# EAGLE design template (EAGLE 6.5.0)
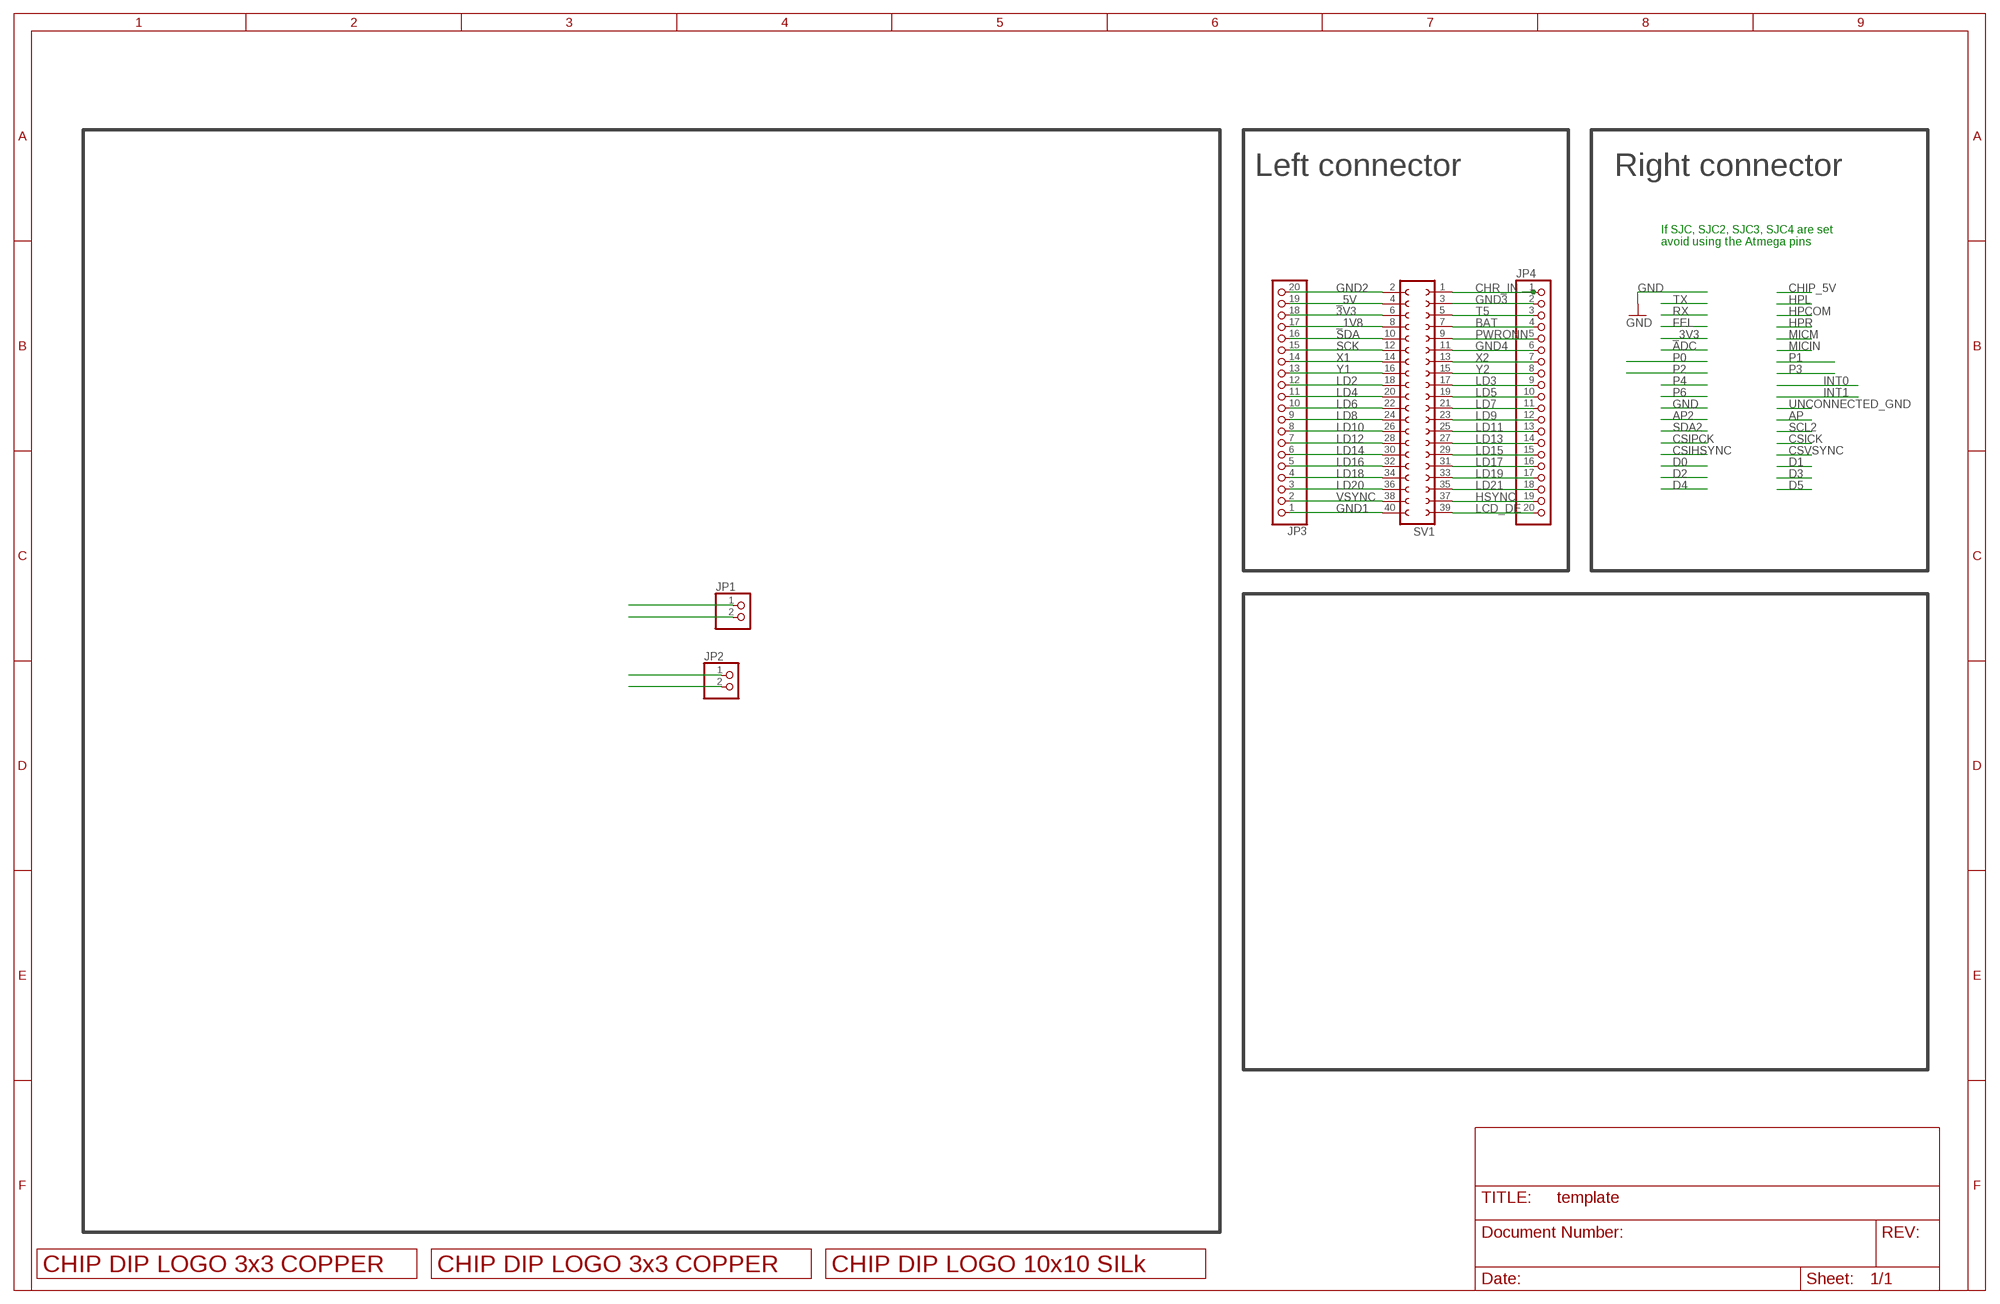
[diagram p0: schematic, sheet 1]

## Parts
JP1  PINHD-1X2  [1X02]
JP2  PINHD-1X2  [1X02]
JP3  PINHD-1X20  [1X20]
JP4  PINHD-1X20  [1X20]
SV1  FE20-2  [FE20-2]
U$2  LOGO_3X3_COPPER  [LOGO_3X3_COPPER]
U$4  LOGO_3X3_COPPER  [LOGO_3X3_COPPER]
U$5  LOGO_10X10_SILK  [LOGO_10X10_SILK]

## Nets
3V3: JP2.2 JP3.18 SV1.6
_1V8: JP3.17 SV1.8
_5V: JP3.19 SV1.4
BAT: JP4.4 SV1.7
CHR_IN: JP1.1 JP4.1 SV1.1
GND1: JP3.1 SV1.40
GND2: JP1.2 JP3.20 SV1.2
GND3: JP2.1 JP4.2 SV1.3
GND4: JP4.6 SV1.11
HSYNC: JP4.19 SV1.37
LCD_DE: JP4.20 SV1.39
LD2: JP3.12 SV1.18
LD3: JP4.9 SV1.17
LD4: JP3.11 SV1.20
LD5: JP4.10 SV1.19
LD6: JP3.10 SV1.22
LD7: JP4.11 SV1.21
LD8: JP3.9 SV1.24
LD9: JP4.12 SV1.23
LD10: JP3.8 SV1.26
LD11: JP4.13 SV1.25
LD12: JP3.7 SV1.28
LD13: JP4.14 SV1.27
LD14: JP3.6 SV1.30
LD15: JP4.15 SV1.29
LD16: JP3.5 SV1.32
LD17: JP4.16 SV1.31
LD18: JP3.4 SV1.34
LD19: JP4.17 SV1.33
LD20: JP3.3 SV1.36
LD21: JP4.18 SV1.35
PWRONN: JP4.5 SV1.9
SCK: JP3.15 SV1.12
SDA: JP3.16 SV1.10
T5: JP4.3 SV1.5
VSYNC: JP3.2 SV1.38
X1: JP3.14 SV1.14
X2: JP4.7 SV1.13
Y1: JP3.13 SV1.16
Y2: JP4.8 SV1.15

## Notes on the sheet
- Left connector | Right connector
- If SJC, SJC2, SJC3, SJC4 are set 
  avoid using the Atmega pins

## Library data of the parts
JP1 JP2 = pinhead:PINHD-1X2: PIN HEADER
JP3 JP4 = pinhead:PINHD-1X20: PIN HEADER
SV1 = con-lsta:FE20-2: FEMALE HEADER; OC_FARNELL: unknown; OC_NEWARK: unknown
U$2 U$4 = logo:LOGO_3X3_COPPER
U$5 = logo:LOGO_10X10_SILK

## Board
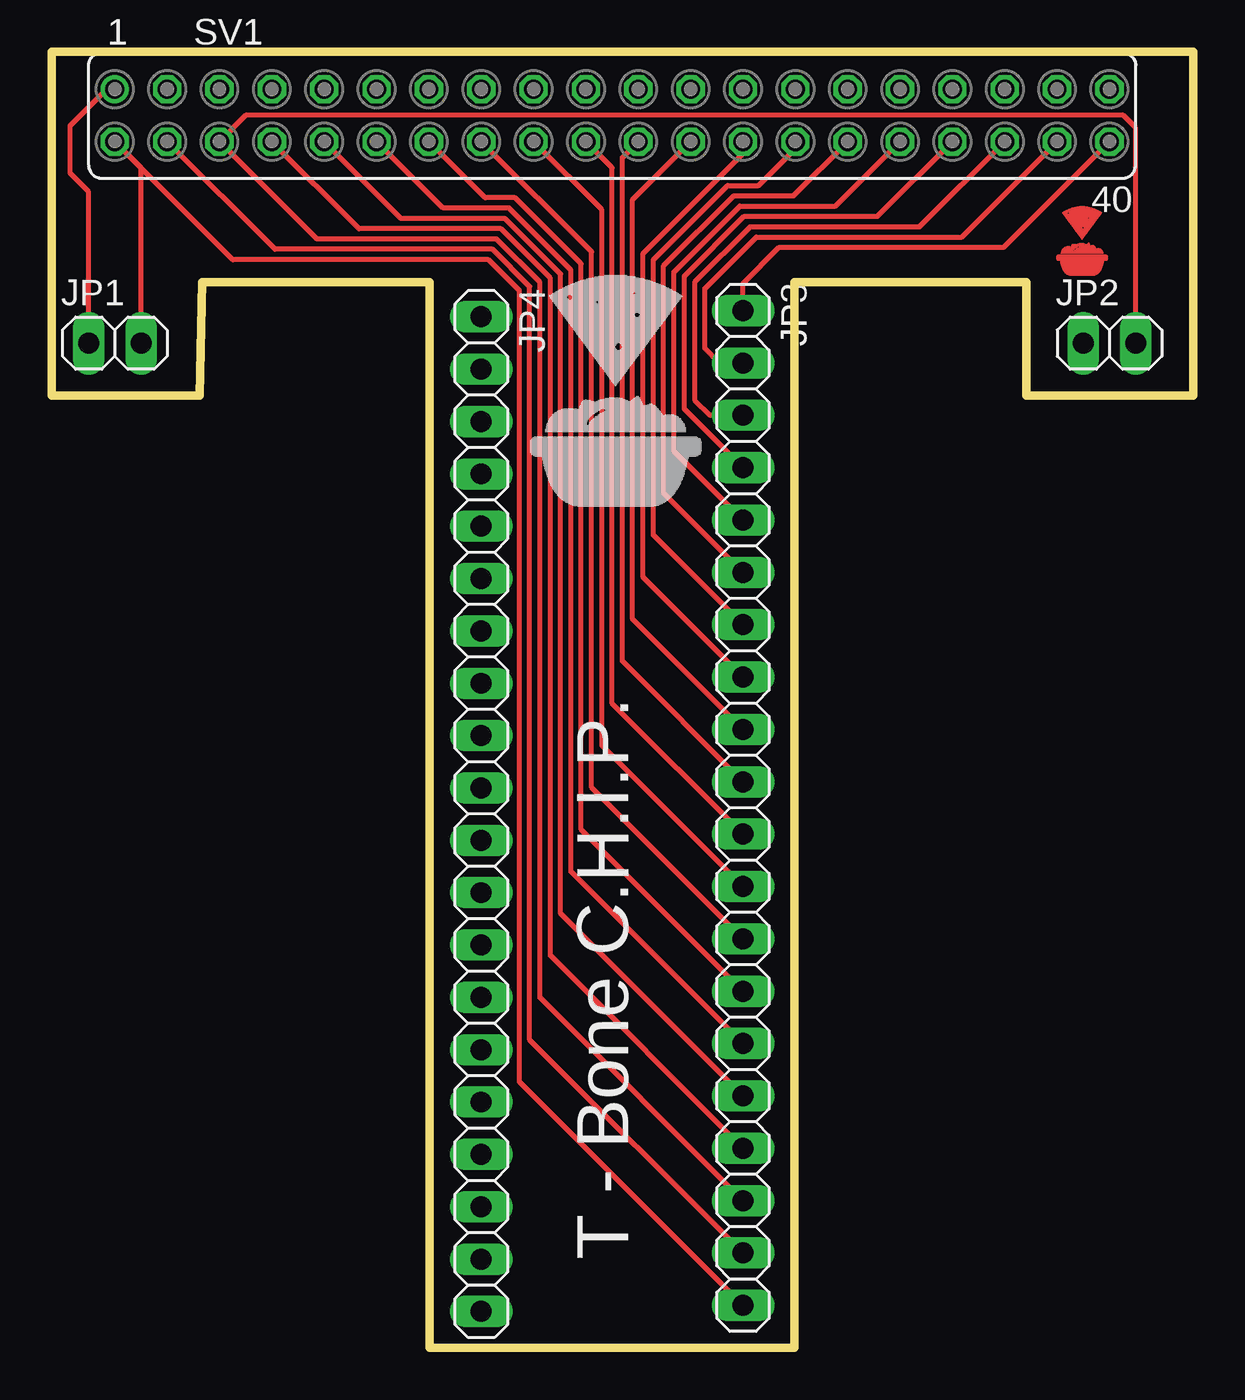
[diagram p1: board, top side]
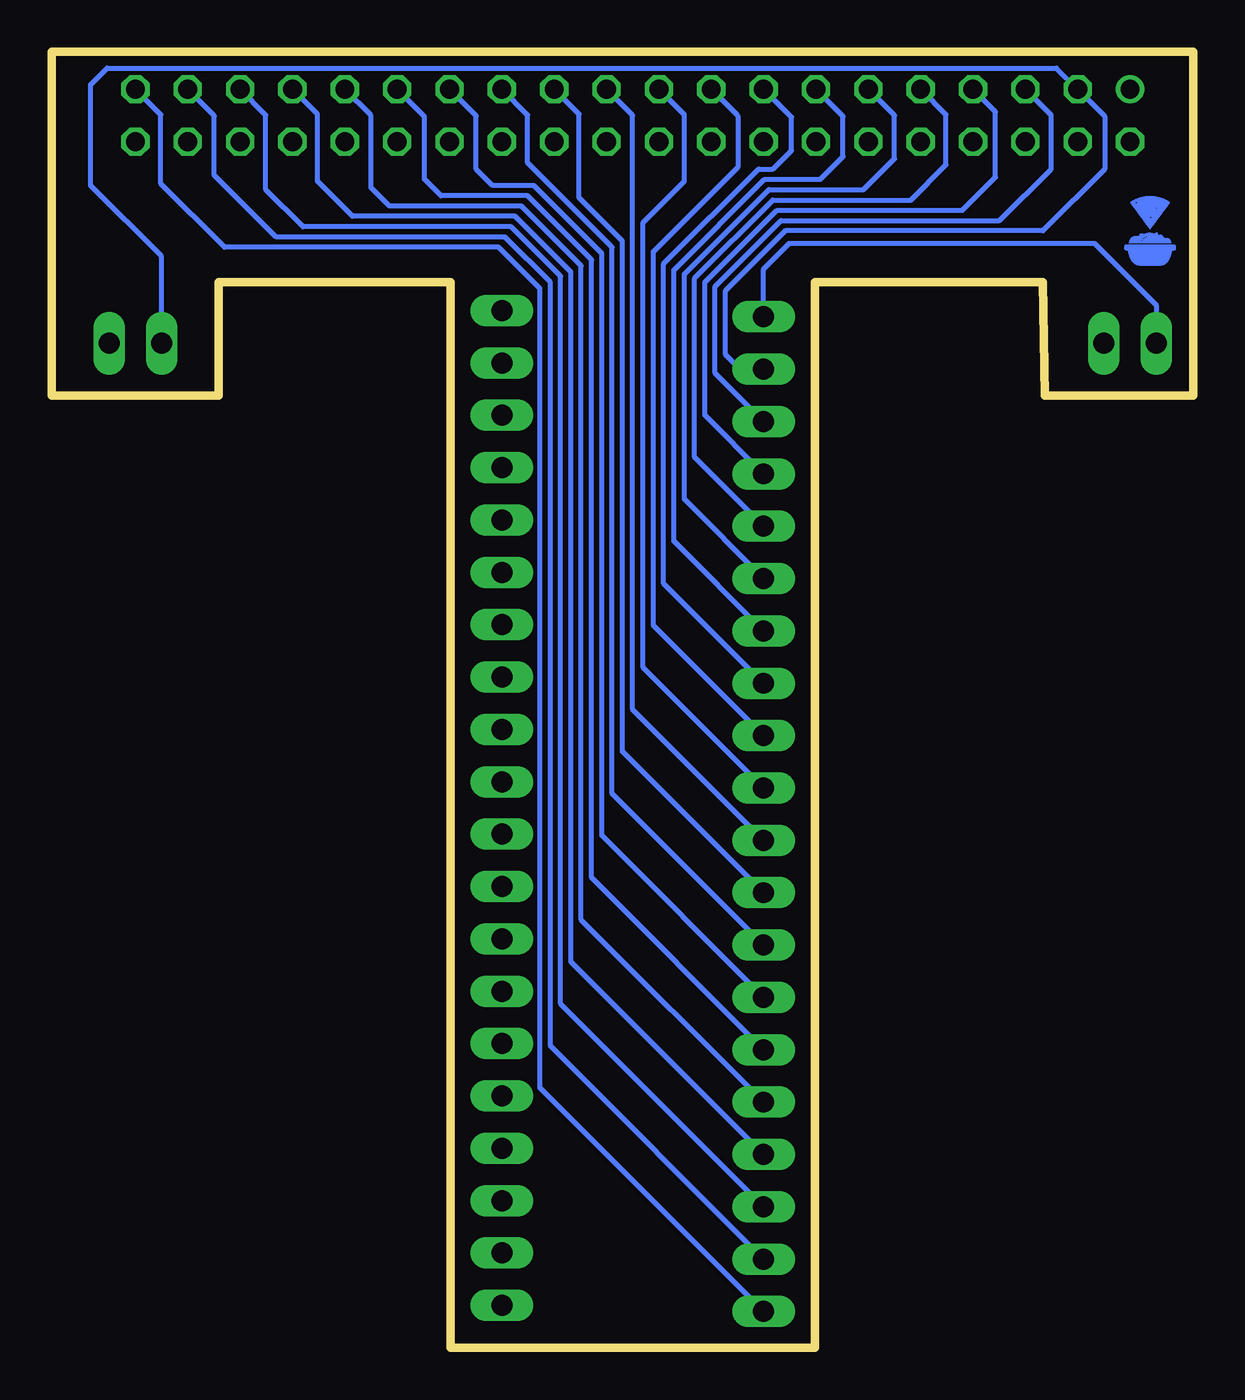
[diagram p2: board, bottom side, seen from below]

Size 55.4 x 62.9 mm. Coordinates in mm from the lower left corner, seen from the top.
Outline: 55.4,62.9 55.4,46.2 47.3,46.2 47.3,51.7 36.05,51.7 36.05,0 18.35,0 18.35,51.7 7.3,51.7 7.2,46.2 0,46.2 0,62.9 55.4,62.9
Copper layers (1*16): Top 0.0356mm / dielectric 1.5011mm / Bottom 0.0356mm
Design rules "LaenPCBOrder": minimum track width 6mil, minimum drill 13mil, track to track 6mil, track to pad 6mil, pad to pad 6mil, via to via 6mil, smd to smd 6mil, copper to edge 15mil, drill to drill 6mil, minimum pad ring 7mil, minimum via ring 7mil, stop-mask expansion 3mil, vias tented up to drill 0mil, thermal gap 10mil

### Footprints (pad centres in the part's own frame; a part is rotated, then mirrored left to right if it is on the bottom)
1X02 = drill 1.016 long: 1 -1.27,0; 2 1.27,0
1X20 = drill 1.016 long: 1 -24.13,0; 2 -21.59,0; 3 -19.05,0; 4 -16.51,0; 5 -13.97,0; 6 -11.43,0; 7 -8.89,0; 8 -6.35,0; 9 -3.81,0; 10 -1.27,0; 11 1.27,0; 12 3.81,0; 13 6.35,0; 14 8.89,0; 15 11.43,0; 16 13.97,0; 17 16.51,0; 18 19.05,0; 19 21.59,0; 20 24.13,0
FE20-2 = drill 0.914: 1 -24.13,1.27 | drill 0.914 octagon: 2 -24.13,-1.27; 3 -21.59,1.27; 4 -21.59,-1.27; 5 -19.05,1.27; 6 -19.05,-1.27; 7 -16.51,1.27; 8 -16.51,-1.27; 9 -13.97,1.27; 10 -13.97,-1.27; 11 -11.43,1.27; 12 -11.43,-1.27; 13 -8.89,1.27; 14 -8.89,-1.27; 15 -6.35,1.27; 16 -6.35,-1.27; 17 -3.81,1.27; 18 -3.81,-1.27; 19 -1.27,1.27; 20 -1.27,-1.27; 21 1.27,1.27; 22 1.27,-1.27; 23 3.81,1.27; 24 3.81,-1.27; 25 6.35,1.27; 26 6.35,-1.27; 27 8.89,1.27; 28 8.89,-1.27; 29 11.43,1.27; 30 11.43,-1.27; 31 13.97,1.27; 32 13.97,-1.27; 33 16.51,1.27; 34 16.51,-1.27; 35 19.05,1.27; 36 19.05,-1.27; 37 21.59,1.27; 38 21.59,-1.27; 39 24.13,1.27; 40 24.13,-1.27

### Placement (x,y rotation side)
JP1  3.07,48.75 0 top
JP2  51.33,48.75 0 top
JP3  33.55,26.2 270 top
JP4  20.85,25.9 270 top
SV1  27.2,59.8 0 top
U$2  50,53.7 0 top
U$4  2.1,54.2 0 bottom
U$5  23.2,40.8 0 top

### Tracks (layer width: path | path; a pad name or v marks a point on that pad's centre or on a via)
3V3
  Top 0.254: JP3.18 23.7,17 23.7,51.7 21.6,53.8 12.88,53.8 SV1.6 9.42,59.8 52,59.8 52.6,59.2 JP2.2
_1V8
  Top 0.254: JP3.17 24.2,19.04 24.2,51.9 21.8,54.3 14.92,54.3 SV1.8
_5V
  Top 0.254: JP3.19 23.2,14.96 23.2,51.5 21.4,53.3 10.84,53.3 SV1.4
BAT
  Bottom 0.254: JP4.4 23.7,45.26 23.7,51.7 20.2,55.2 11.2,55.2 9.6,56.8 9.6,59.98 SV1.7
CHR_IN
  Top 0.254: JP1.1 1.8,56.1 0.9,57 0.9,59.3 2.67,61.07 SV1.1
  Bottom 0.254: JP4.1 20.85,52.35 19.6,53.6 4.8,53.6 1.8,50.6 JP1.1
GND1
  Top 0.254: JP3.1 33.55,51.65 35.3,53.4 46.2,53.4 SV1.40
GND2
  Top 0.254: JP3.20 22.7,12.92 22.7,51.3 21.2,52.8 8.8,52.8 SV1.2 4.34,57.26 JP1.2
GND3
  Bottom 0.254: JP4.2 21.99,47.49 22.7,48.2 22.7,51.3 19.8,54.2 7.3,54.2 4.3,57.2 4.3,59.76 SV1.3 6.64,62.1 52.7,62.1 53.5,61.3 53.5,56.4 50.06,52.96 JP2.1
GND4
  Bottom 0.254: JP4.6 24.7,41.18 24.7,52.1 20.6,56.2 16,56.2 14.5,57.7 14.5,59.8 SV1.11
HSYNC
  Bottom 0.254: JP4.19 31.2,14.66 31.2,51.7 33.4,53.9 44.5,53.9 47.5,56.9 47.5,59.78 SV1.37
LCD_DE
  Bottom 0.254: JP4.20 31.7,12.62 31.7,51.4 33.7,53.4 47,53.4 50.1,56.5 50.1,59.84 SV1.39
LD2
  Top 0.254: JP3.12 26.7,29.24 26.7,55.22 SV1.18
LD3
  Bottom 0.254: JP4.9 26.2,35.06 26.2,53.2 22.1,57.3 22.1,59.78 SV1.17
LD4
  Top 0.254: JP3.11 27.2,31.28 27.2,57.26 SV1.20
LD5
  Bottom 0.254: JP4.10 26.7,33.02 26.7,54.6 24.7,56.6 24.7,59.84 SV1.19
LD6
  Top 0.254: JP3.10 27.7,33.32 27.7,57.76 SV1.22
LD7
  Bottom 0.254: JP4.11 27.2,30.98 27.2,59.8 SV1.21
LD8
  Top 0.254: JP3.9 28.2,35.36 28.2,55.72 SV1.24
LD9
  Bottom 0.254: JP4.12 27.7,28.94 27.7,53.7 29.8,55.8 29.8,59.86 SV1.23
LD10
  Top 0.254: JP3.8 28.7,37.4 28.7,53.1 33.55,57.95 SV1.26
LD11
  Bottom 0.254: JP4.13 28.2,26.9 28.2,53.4 32.3,57.5 32.3,59.82 SV1.25
LD12
  Top 0.254: JP3.7 29.2,39.44 29.2,52.8 32.8,56.4 34.3,56.4 36.09,58.19 SV1.28
LD13
  Bottom 0.254: JP4.14 28.7,24.86 28.7,53.1 32,56.4 34,56.4 34.8,57.2 34.8,59.78 SV1.27
LD14
  Top 0.254: JP3.6 29.7,41.48 29.7,52.5 33.1,55.9 36,55.9 SV1.30
LD15
  Bottom 0.254: JP4.15 29.2,22.82 29.2,52.8 32.3,55.9 36.5,55.9 37.3,56.7 37.3,59.74 SV1.29
LD16
  Top 0.254: JP3.5 30.2,43.52 30.2,52.2 33.4,55.4 38.04,55.4 SV1.32
LD17
  Bottom 0.254: JP4.16 29.7,20.78 29.7,52.5 32.6,55.4 39,55.4 39.9,56.3 39.9,59.8 SV1.31
LD18
  Top 0.254: JP3.4 30.7,45.56 30.7,52 33.6,54.9 40.08,54.9 SV1.34
LD19
  Bottom 0.254: JP4.17 30.2,18.74 30.2,52.2 32.9,54.9 40.8,54.9 42.5,56.6 42.5,59.86 SV1.33
LD20
  Top 0.254: JP3.3 31.95,45.25 31.2,46 31.2,51.7 33.9,54.4 42.12,54.4 SV1.36
LD21
  Bottom 0.254: JP4.18 30.7,16.7 30.7,52 33.1,54.4 43.2,54.4 45,56.2 45,59.82 SV1.35
PWRONN
  Bottom 0.254: JP4.5 24.2,43.22 24.2,51.9 20.4,55.7 13.7,55.7 12,57.4 12,59.84 SV1.9
SCK
  Top 0.254: JP3.15 25.2,23.12 25.2,52.3 22.2,55.3 19,55.3 SV1.12
SDA
  Top 0.254: JP3.16 24.7,21.08 24.7,52.1 22,54.8 16.96,54.8 SV1.10
T5
  Bottom 0.254: JP4.3 23.2,47.3 23.2,51.5 20,54.7 9.4,54.7 6.9,57.2 6.9,59.82 SV1.5
VSYNC
  Top 0.254: JP3.2 32.41,47.79 31.7,48.5 31.7,51.4 34.2,53.9 44.16,53.9 SV1.38
X1
  Top 0.254: JP3.14 25.7,25.16 25.7,52.6 22.5,55.8 21.04,55.8 SV1.14
X2
  Bottom 0.254: JP4.7 25.2,39.14 25.2,52.3 20.8,56.7 18.1,56.7 17,57.8 17,59.76 SV1.13
Y1
  Top 0.254: JP3.13 26.2,27.2 26.2,53.18 SV1.16
Y2
  Bottom 0.254: JP4.8 25.7,37.1 25.7,52.6 21.1,57.2 20.4,57.2 19.5,58.1 19.5,59.72 SV1.15

### Text on the board
tNames: T - Bone C.H.I.P.